# Altium project OZ440-SE100-CAR002.PrjPcb
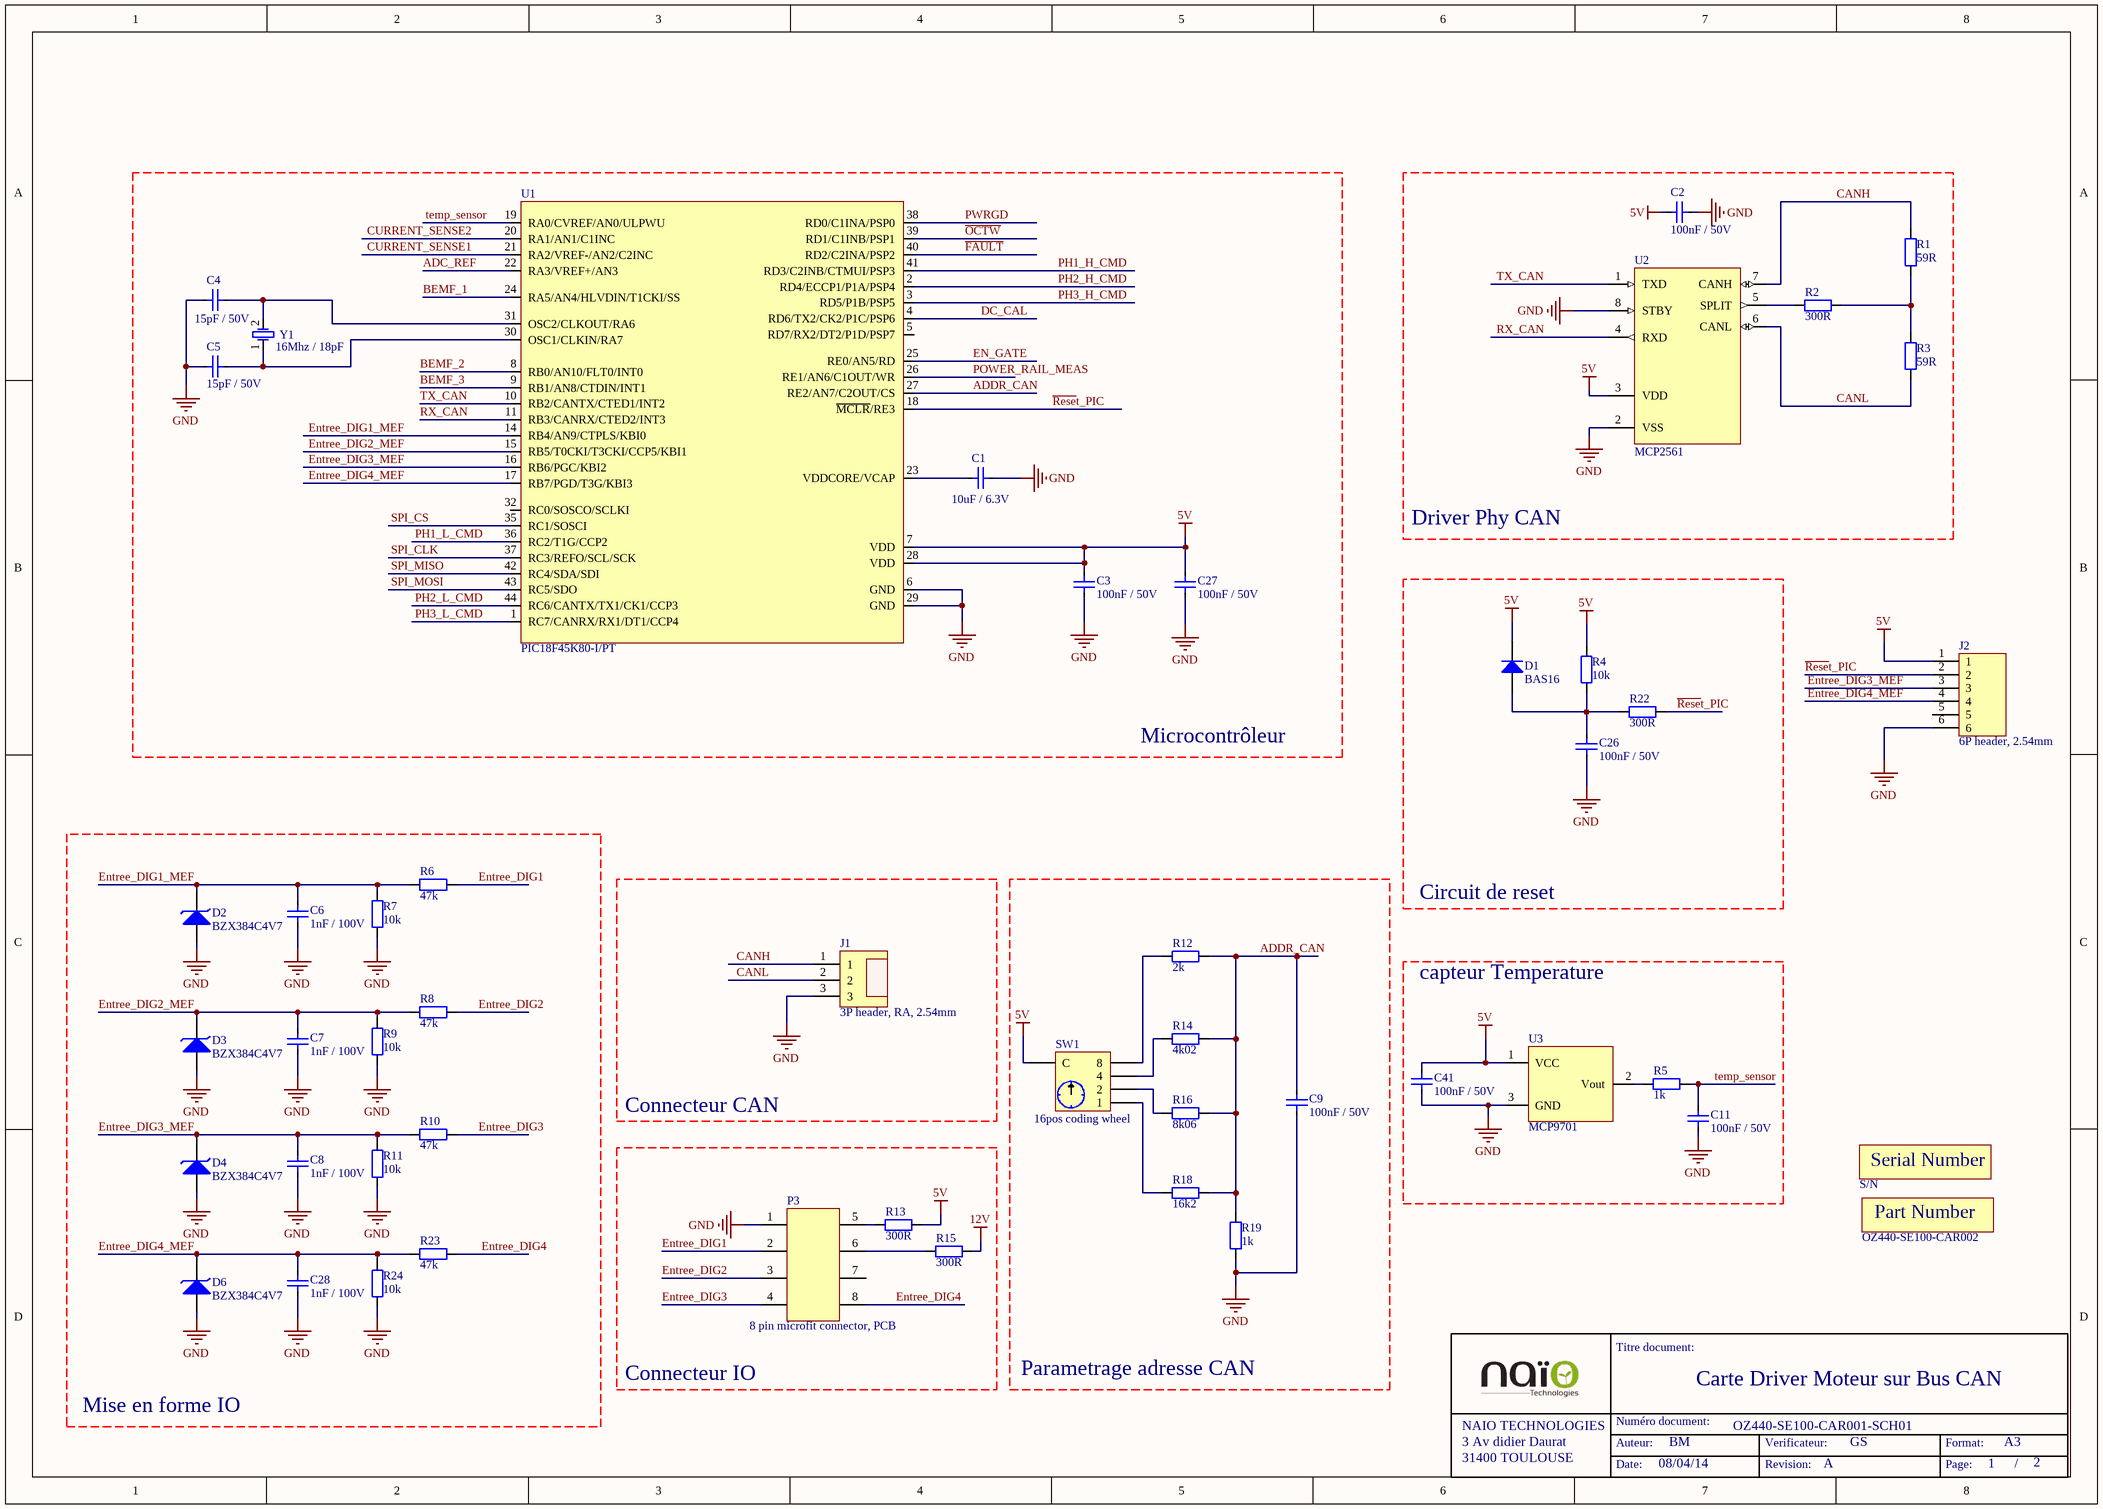
[diagram p0: OZ440-SE100-CAR002-SCH01_logique - Copie.SchDoc]
AssyDocumentNumber: OZ440-SE100-CAR002-Asb01; BoardName: Carte moteurs CAN; BoardPartNumber: OZ440-SE100-CAR002; BoardRevision: V1; DesignEngineer: Bruno M; DrillDocumentNumber: OZ440-SE100-CAR002-DRL01; ProjectTitle: Carte moteurs CAN; VerifEngineer: Pascal S
2 sheets, 110 parts. Net scope: global (net labels, ports and power ports of the same name join across sheets).
Board file: OZ440-SE100-CAR002.PcbDoc
Sheets:
  OZ440-SE100-CAR002-SCH01_logique - Copie.SchDoc
  OZ440-SE100-CAR002-SCH02_puissance.SchDoc

## Sheet OZ440-SE100-CAR002-SCH01_logique - Copie.SchDoc: Carte Driver Moteur sur Bus CAN
size A3; Date: 08/04/14; CheckedBy: GS; Author: BM; DocumentNumber: OZ440-SE100-CAR001-SCH01; Revision: A; SheetNumber: 1; SheetTotal: 2

### Parts
C1  Displayed reference: 10uF / 6.3V  [C0805-STD]  (hidden comment: CAP-SMD)
C2  Displayed reference: 100nF / 50V  [C0805-STD]  (hidden comment: CAP-SMD)
C3  Displayed reference: 100nF / 50V  [C0805-STD]  (hidden comment: CAP-SMD)
C4  Displayed reference: 15pF / 50V  [C0805-STD]  (hidden comment: CAP-SMD)
C5  Displayed reference: 15pF / 50V  [C0805-STD]  (hidden comment: CAP-SMD)
C6  Displayed reference: 1nF / 100V  [C0805-STD]  (hidden comment: CAP-SMD)
C7  Displayed reference: 1nF / 100V  [C0805-STD]  (hidden comment: CAP-SMD)
C8  Displayed reference: 1nF / 100V  [C0805-STD]  (hidden comment: CAP-SMD)
C9  Displayed reference: 100nF / 50V  [C0805-STD]  (hidden comment: CAP-SMD)
C11  Displayed reference: 100nF / 50V  [C0805-STD]  (hidden comment: CAP-SMD)
C26  Displayed reference: 100nF / 50V  [C0805-STD]  (hidden comment: CAP-SMD)
C27  Displayed reference: 100nF / 50V  [C0805-STD]  (hidden comment: CAP-SMD)
C28  Displayed reference: 1nF / 100V  [C0805-STD]  (hidden comment: CAP-SMD)
C41  Displayed reference: 100nF / 50V  [C0805-STD]  (hidden comment: CAP-SMD)
D1  Displayed reference: BAS16  [SOT23-STD]  (hidden comment: BAS16-SOT23)
D2  Displayed reference: BZX384C4V7  [SOD323-SPE-BZX384]  (hidden comment: DIODE_ZENER-SOD323)
D3  Displayed reference: BZX384C4V7  [SOD323-SPE-BZX384]  (hidden comment: DIODE_ZENER-SOD323)
D4  Displayed reference: BZX384C4V7  [SOD323-SPE-BZX384]  (hidden comment: DIODE_ZENER-SOD323)
D6  Displayed reference: BZX384C4V7  [SOD323-SPE-BZX384]  (hidden comment: DIODE_ZENER-SOD323)
J1  Displayed reference: 3P header, RA, 2.54mm  [CONN-SPE_MOLEX_0015913033]  (hidden comment: CONN-STD-3P_1ROW)
J2  Displayed reference: 6P header, 2.54mm  [6P_HEADER-STD_TH_1ROW]  (hidden comment: CONN-STD-6P_1ROW)
P3  Displayed reference: 8 pin microfit connector, PCB  [CONN-SPE_MOLEX_43045-0801]  (hidden comment: CONN-SPE-8P_MOLEX_43045-0801)
PN1  Displayed reference: OZ440-SE100-CAR002  [PART_NUMBER-STD]  (hidden comment: PART-NUMBER)
R1  Displayed reference: 59R  [R0805-STD]  (hidden comment: RES-SMD)
R2  Displayed reference: 300R  [R0805-STD]  (hidden comment: RES-SMD)
R3  Displayed reference: 59R  [R0805-STD]  (hidden comment: RES-SMD)
R4  Displayed reference: 10k  [R0805-STD]  (hidden comment: RES-SMD)
R5  Displayed reference: 1k  [R0805-STD]  (hidden comment: RES-SMD)
R6  Displayed reference: 47k  [R0805-STD]  (hidden comment: RES-SMD)
R7  Displayed reference: 10k  [R0805-STD]  (hidden comment: RES-SMD)
R8  Displayed reference: 47k  [R0805-STD]  (hidden comment: RES-SMD)
R9  Displayed reference: 10k  [R0805-STD]  (hidden comment: RES-SMD)
R10  Displayed reference: 47k  [R0805-STD]  (hidden comment: RES-SMD)
R11  Displayed reference: 10k  [R0805-STD]  (hidden comment: RES-SMD)
R12  Displayed reference: 2k  [R0805-STD]  (hidden comment: RES-SMD)
R13  Displayed reference: 300R  [R0805-STD]  (hidden comment: RES-SMD)
R14  Displayed reference: 4k02  [R0805-STD]  (hidden comment: RES-SMD)
R15  Displayed reference: 300R  [R0805-STD]  (hidden comment: RES-SMD)
R16  Displayed reference: 8k06  [R0805-STD]  (hidden comment: RES-SMD)
R18  Displayed reference: 16k2  [R0805-STD]  (hidden comment: RES-SMD)
R19  Displayed reference: 1k  [R0805-STD]  (hidden comment: RES-SMD)
R22  Displayed reference: 300R  [R0805-STD]  (hidden comment: RES-SMD)
R23  Displayed reference: 47k  [R0805-STD]  (hidden comment: RES-SMD)
R24  Displayed reference: 10k  [R0805-STD]  (hidden comment: RES-SMD)
SN1  Displayed reference: S/N  [SERIAL_NUMBER-STD]  (hidden comment: SERIAL-NUMBER)
SW1  Displayed reference: 16pos coding wheel  [SW-SPE-CTS_220-AMA16]  (hidden comment: Switch-STD-coding_wheel)
U1  Displayed reference: PIC18F45K80-I/PT  [TQFP44-SPE-PIC18F45k80]  (hidden comment: P18F45K80-TQFP44)
U2  Displayed reference: MCP2561  [SO8-SPE-MCP2561]  (hidden comment: MCP2561-SOIC08)
U3  Displayed reference: MCP9701  [SOT23-STD]  (hidden comment: MCP97XX-SOT23)
Y1  Displayed reference: 16Mhz / 18pF  [XTAL-SPE-HC49_SMD]  (hidden comment: XTAL-SMD)

### Nets
5V: C2.2 C3.2 C27.2 C41.2 D1.3(K) J2.1 R4.2 R13.2 SW1.C U1.7(VDD) U1.28(VDD) U2.3(VDD) U3.1(VCC)
12V: R15.2
GND: C1.2 C2.1 C3.1 C4.1 C5.1 C6.1 C7.1 C8.1 C9.1 C11.1 C26.1 C27.1 C28.1 C41.1 D2.A D3.A D4.A D6.A J1.3 J2.6 P3.1 R7.1 R9.1 R11.1 R19.1 R24.1 U1.6(GND) U1.29(GND) U2.2(VSS) U2.8(STBY) U3.3(GND)
~{FAULT}: U1.40(RD2/C2INA/PSP2)
~{OCTW}: U1.39(RD1/C1INB/PSP1)
~{Rese}t_PIC: J2.2 R22.2 U1.18(~{MCLR}/RE3)
ADC_REF: U1.22(RA3/VREF+/AN3)
ADDR_CAN: C9.2 R12.2 R14.2 R16.2 R18.2 R19.2 U1.27(RE2/AN7/C2OUT/CS)
BEMF_1: U1.24(RA5/AN4/HLVDIN/T1CKI/SS)
BEMF_2: U1.8(RB0/AN10/FLT0/INT0)
BEMF_3: U1.9(RB1/AN8/CTDIN/INT1)
CANH: J1.1 R1.2 U2.7(CANH)
CANL: J1.2 R3.1 U2.6(CANL)
CURRENT_SENSE1: U1.21(RA2/VREF-/AN2/C2INC)
CURRENT_SENSE2: U1.20(RA1/AN1/C1INC)
DC_CAL: U1.4(RD6/TX2/CK2/P1C/PSP6)
EN_GATE: U1.25(RE0/AN5/RD)
Entree_DIG1: P3.2 R6.1
Entree_DIG1_MEF: C6.2 D2.K R6.2 R7.2 U1.14(RB4/AN9/CTPLS/KBI0)
Entree_DIG2: P3.3 R8.1
Entree_DIG2_MEF: C7.2 D3.K R8.2 R9.2 U1.15(RB5/T0CKI/T3CKI/CCP5/KBI1)
Entree_DIG3: P3.4 R10.1
Entree_DIG3_MEF: C8.2 D4.K J2.3 R10.2 R11.2 U1.16(RB6/PGC/KBI2)
Entree_DIG4: P3.8 R23.1
Entree_DIG4_MEF: C28.2 D6.K J2.4 R23.2 R24.2 U1.17(RB7/PGD/T3G/KBI3)
PH1_H_CMD: U1.41(RD3/C2INB/CTMUI/PSP3)
PH1_L_CMD: U1.36(RC2/T1G/CCP2)
PH2_H_CMD: U1.2(RD4/ECCP1/P1A/PSP4)
PH2_L_CMD: U1.44(RC6/CANTX/TX1/CK1/CCP3)
PH3_H_CMD: U1.3(RD5/P1B/PSP5)
PH3_L_CMD: U1.1(RC7/CANRX/RX1/DT1/CCP4)
POWER_RAIL_MEAS: U1.26(RE1/AN6/C1OUT/WR)
PWRGD: U1.38(RD0/C1INA/PSP0)
RX_CAN: U1.11(RB3/CANRX/CTED2/INT3) U2.4(RXD)
SPI_CLK: U1.37(RC3/REFO/SCL/SCK)
SPI_CS: U1.35(RC1/SOSCI)
SPI_MISO: U1.42(RC4/SDA/SDI)
SPI_MOSI: U1.43(RC5/SDO)
temp_sensor: C11.2 R5.2 U1.19(RA0/CVREF/AN0/ULPWU)
TX_CAN: U1.10(RB2/CANTX/CTED1/INT2) U2.1(TXD)
NetC1_1: C1.1 U1.23(VDDCORE/VCAP)
NetC4_2: C4.2 U1.31(OSC2/CLKOUT/RA6) Y1.2(OSC2)
NetC5_2: C5.2 U1.30(OSC1/CLKIN/RA7) Y1.1(OSC1)
NetC26_2: C26.2 D1.1(A) R4.1 R22.1
NetP3_5: P3.5 R13.1
NetP3_6: P3.6 R15.1
NetR1_1: R1.1 R2.2 R3.2
NetR2_1: R2.1 U2.5(SPLIT)
NetR5_1: R5.1 U3.2(Vout)
NetR12_1: R12.1 SW1.8
NetR14_1: R14.1 SW1.4
NetR16_1: R16.1 SW1.2
NetR18_1: R18.1 SW1.1

Not connected (* = marked no-connect by the designer): J2 5; P3 7; U1 5(RD7/RX2/DT2/P1D/PSP7) 32(RC0/SOSCO/SCLKI)

### Notes on the sheet
- Driver Phy CAN
- Microcontrôleur
- Circuit de reset
- capteur Temperature
- Connecteur CAN
- Connecteur IO
- Parametrage adresse CAN
- Mise en forme IO
- Titre document:
- NAIO TECHNOLOGIES
- 3 Av didier Daurat
- 31400 TOULOUSE
- Auteur:
- Numéro document:
- Verificateur:
- Format:
- A3
- Date:
- Revision:
- Page:
- /
- (in symbol Large part number) Part Number

### Library data of the parts
C1 = C0805C106K9PACxx: 0805 10uF / 6.3V X5R ceramic capacitor; Manufacturer: Kemet; Max Voltage: 6.3; Tolerance: +/- 10%; Validated: N; Reference: C0805C106K9PACxx; Value: 10uF; Material: X5R; Footprint description: standard Capacitor 0805; Pin Count: 2; helpURL: http://www.farnell.com/datasheets/40863.pdf; Supplier 1: Farnell; Supplier Part Number 1: 1643357; Supplier 2: Digi-Key; Supplier Part Number 2: 399-3138-1-ND
C2 C3 C9 C11 C26 C27 C41 = VJ0805Y104KXAxx: 0805 100nF / 50V  X7R ceramic capacitor; Manufacturer: vishay; Max Voltage: 50; Tolerance: +/- 10%; Validated: N; Reference: VJ0805Y104KXAxx; Value: 100nF; Material: X7R; Footprint description: standard Capacitor 0805; Pin Count: 2; helpURL: http://www.vishay.com/docs/45200/highrels.pdf; Supplier 1: Farnell; Supplier Part Number 1: 1612208; Supplier 2: Digi-Key; Supplier Part Number 2: 720-1266-6-ND
C4 C5 = C0805C150J5GACxx: 0805 15pF / 50V COG ceramic capacitor; Manufacturer: Kemet; Max Voltage: 50; Tolerance: +/- 5%; Validated: N; Reference: C0805C150J5GACxx; Value: 15pF; Material: COG; Footprint description: standard Capacitor 0805; Pin Count: 2; helpURL: http://www.farnell.com/datasheets/40863.pdf; Supplier 1: Farnell; Supplier Part Number 1: 1650868; Supplier 2: Digi-Key; Supplier Part Number 2: 399-1111-1-ND
C6-C8 C28 = VJ0805Y102KXBxx: 0805 1nF / 100V X7R ceramic capacitor; Manufacturer: vishay; Max Voltage: 50; Tolerance: +/- 10%; Validated: N; Reference: VJ0805Y102KXBxx; Value: 1nF; Material: X7R; Footprint description: standard Capacitor 0805; Pin Count: 2; helpURL: http://www.vishay.com/docs/45200/highrels.pdf; Supplier 1: Farnell; Supplier Part Number 1: 1555112; Supplier 2: Digi-Key; Supplier Part Number 2: 720-1264-1-ND
D1 = BAS16: 100V / 120mA signal  diode; Manufacturer: NXP; Max Voltage: 100; Max Current: 0.2A; Validated: False; Reference: BAS16; component type: DIODE; Footprint description: Sot23 SMD package; Pin Count: 3; Rev: 2010; helpURL: http://www.nxp.com/documents/data_sheet/BAS16_SER.pdf; Supplier 1: Farnell; Supplier Part Number 1: 1081180; Supplier 2: Digi-Key; Supplier Part Number 2: 568-1596-1-ND
D2-D4 D6 = BZX384C4V7: 4.7V zener diode; Manufacturer: VISHAY; Rated Power: 200mW; Validated: FALSE; Reference: BZX384C4V7; component type: Zener diode; Value: 4.7V; Footprint description: SOD323; Pin Count: 2; Rev: 1.9; helpURL: http://www.vishay.com/docs/85764/bzx384.pdf; Supplier 1: Mouser; Supplier Part Number 1: 771-BZX384-C4V7115; Supplier 2: Farnell; Supplier Part Number 2: 8735700
J1 = 0015913033: 3 pin , 2.54mm SMD header; Manufacturer: Molex; Validated: False; Reference: 0015913033; Footprint description: 3P header, RA, 2.54mm; Pin Count: 3; Rev: G; helpURL: http://www.molex.com/pdm_docs/sd/015913033_sd.pdf; Supplier 1: Mouser; Supplier Part Number 1: 538-15-91-3033; Supplier 2: Digi-Key; Supplier Part Number 2: 0015913033-ND
J2 = 68000-406HLF: 6P, 1 row, 2.54mm header; Manufacturer: FCI; Validated: False; Reference: 68000-406HLF; Footprint description: TH, 6 pin, 2.54mm; Pin Count: 6; Rev: DB; helpURL: http://portal.fciconnect.com/Comergent//fci/drawing/68000.pdf
P3 = 43045-0801: 8 pin Microfit connector; Manufacturer: Molex; Max Voltage: 600V; Max Current: 5A; Validated: False; Reference: 43045-0801; Footprint description: 8 pin SMT connector RA, TH; Pin Count: 8; Rev: F; helpURL: http://www.molex.com/pdm_docs/sd/430450801_sd.pdf; Supplier 1: Mouser; Supplier Part Number 1: 538-43045-0801; Supplier 2: Digi-Key; Supplier Part Number 2: WM3253-ND
PN1 = Large part number: large part number copper identification; Validated: False; Reference: Large part number
R1 R3 = CRCW080559R0FKxx: 59 Ohm 0805 SMD resistor; Manufacturer: Vishay; Value: 59; Tolerance: 1 %; Rated Power: 0.125 W; Validated: No; Reference: CRCW080559R0FKxx; Footprint description: standard 0805 SMD; Pin Count: 2; helpURL: http://www.vishay.com/docs/20035/dcrcwe3.pdf; Supplier 1: Mouser; Supplier Part Number 1: 71-CRCW080559R0FKEA; Supplier 2: Farnell; Supplier Part Number 2: 2138817
R2 R13 R15 R22 = CRCW0805300RFKxx: 300 ohm 0805 SMD resistor; Manufacturer: Vishay; Value: 300; Tolerance: 1%; Rated Power: 0.125W; Validated: No; Reference: CRCW0805300RFKxx; Footprint description: standard 0805 SMD; Pin Count: 2; helpURL: http://www.vishay.com/docs/20035/dcrcwe3.pdf; Supplier 1: Mouser; Supplier Part Number 1: 71-CRCW0805300RFKEA; Supplier 2: Farnell; Supplier Part Number 2: 1152346
R4 R7 R9 R11 R24 = CRCW080510K0FKxx: 10k Ohm 0805 SMD resistor; Manufacturer: Vishay; Value: 10 000; Tolerance: 1 %; Rated Power: 0,125 W; Validated: No; Reference: CRCW080510K0FKxx; Footprint description: standard 0805 SMD; Pin Count: 2; helpURL: http://www.vishay.com/docs/20035/dcrcwe3.pdf; Supplier 1: Farnell; Supplier Part Number 1: 1469856; Supplier 2: Mouser; Supplier Part Number 2: 71-CRCW0805-10K-E3
R5 R19 = CRCW08051K00FKxx: 1k Ohm 0805 SMD resistor; Manufacturer: Vishay; Value: 1 000; Tolerance: 1 %; Rated Power: 0,125 W; Validated: No; Reference: CRCW08051K00FKxx; Footprint description: standard 0805 SMD; Pin Count: 2; helpURL: http://www.vishay.com/docs/20035/dcrcwe3.pdf; Supplier 1: Farnell; Supplier Part Number 1: 1469847; Supplier 2: Mouser; Supplier Part Number 2: 71-CRCW0805-1.0K-E3
R6 R8 R10 R23 = CRCW080547K0FKxx: 47k Ohm 0805 SMD resistor; Manufacturer: Vishay; Value: 47 000; Tolerance: 1 %; Rated Power: 0,125 W; Validated: No; Reference: CRCW080547K0FKxx; Footprint description: standard 0805 SMD; Pin Count: 2; helpURL: http://www.vishay.com/docs/20035/dcrcwe3.pdf; Supplier 1: Farnell; Supplier Part Number 1: 1469929; Supplier 2: Mouser; Supplier Part Number 2: 71-CRCW0805-47K-E3
R12 = CRCW08052K00FKxx: 2k Ohm 0805 SMD resistor; Manufacturer: Vishay; Value: 2 000; Tolerance: 1%; Rated Power: 0.125W; Validated: No; Reference: CRCW08052K00FKxx; Footprint description: standard 0805 SMD; Pin Count: 2; helpURL: http://www.vishay.com/docs/20035/dcrcwe3.pdf; Supplier 1: Mouser; Supplier Part Number 1: 71-CRCW08052K00FKEB; Supplier 2: Farnell; Supplier Part Number 2: 1469884
R14 = CRCW08054K02FKxx: 4k02 Ohm 0805 SMD resistor; Manufacturer: Vishay; Value: 4 020; Tolerance: 1%; Rated Power: 0.125W; Validated: No; Reference: CRCW08054K02FKxx; Footprint description: standard 0805 SMD; Pin Count: 2; helpURL: http://www.vishay.com/docs/20035/dcrcwe3.pdf; Supplier 1: Farnell; Supplier Part Number 1: 1469920; Supplier 2: Mouser; Supplier Part Number 2: 71-CRCW0805-4.02K-E3
R16 = CRCW08058K06FKxx: 8k06 Ohm 0805 SMD resistor; Manufacturer: Vishay; Value: 8 060; Tolerance: 1%; Rated Power: 0.125W; Validated: No; Reference: CRCW08058K06FKxx; Footprint description: standard 0805 SMD; Pin Count: 2; helpURL: http://www.vishay.com/docs/20035/dcrcwe3.pdf; Supplier 1: Farnell; Supplier Part Number 1: 1653038; Supplier 2: Mouser; Supplier Part Number 2: 71-CRCW0805-8.06K-E3
R18 = CRCW080516K2FKxx: 16k2 Ohm 0805 SMD resistor; Manufacturer: Vishay; Value: 16200; Tolerance: 1%; Rated Power: 0.125W; Validated: No; Reference: CRCW080516K2FKxx; Footprint description: standard 0805 SMD; Pin Count: 2; helpURL: http://www.vishay.com/docs/20035/dcrcwe3.pdf; Supplier 1: Mouser; Supplier Part Number 1: 71-CRCW0805-16.2K-E3; Supplier 2: Farnell; Supplier Part Number 2: 1469878
SN1 = Serial Number: serial number copper identification; Validated: False; Reference: Serial Number
SW1 = 220AMA16x: 16 positions rotary dip switch; Manufacturer: CTS; Validated: False; Reference: 220AMA16x; Footprint description: 10x10mm SMD; Pin Count: 6; Rev: 20/02/14; helpURL: http://www.ctscorp.com/components/Datasheets/220.pdf; Supplier 1: Mouser; Supplier Part Number 1: 774-220AMA16R; Supplier 2: Digi-Key; Supplier Part Number 2: CT3072-6-ND
U1 = PIC18F45K80-I/PT: Pic microcontroller with embeded CAN controller; Manufacturer: MICROCHIP; Validated: False; Reference: PIC18F45K80-I/PT; Footprint description: standard TQFP 44 pin; Pin Count: 44; Rev: F; helpURL: http://ww1.microchip.com/downloads/en/DeviceDoc/39977f.pdf; Supplier 1: Farnell; Supplier Part Number 1: 1823169; Supplier 2: Mouser; Supplier Part Number 2: 579-PIC18F45K80-I/PT
U2 = MCP2561-E/SN: CAN transceiver with common mode stabilisation; Manufacturer: Microchip; Max Voltage: 5.5V; Validated: False; Reference: MCP2561-E/SN; Footprint description: standard SO8; Pin Count: 8; Rev: B; helpURL: http://ww1.microchip.com/downloads/en/DeviceDoc/25167B.pdf; Supplier 1: Farnell; Supplier Part Number 1: 2362837; Supplier 2: Mouser; Supplier Part Number 2: 579-MCP2561-E/SN
U3 = MCP9701AT-E/TT: temperature sensor with voltage output; Manufacturer: Microchip; Max Voltage: 5.5V; Reference: MCP9701AT-E/TT; Footprint description: SOT23; Pin Count: 3; Rev: E; helpURL: http://ww1.microchip.com/downloads/en/DeviceDoc/21942e.pdf; Supplier 1: Mouser; Supplier Part Number 1: 579-MCP9701AT-E/TT; Supplier 2: Farnell; Supplier Part Number 2: 1834864
Y1 = MCRSD16000F183000RR: 16Mhz Crystal; Manufacturer: Multicomp; Value: 16 000; Validated: False; Reference: MCRSD16000F183000RR; Footprint description: HC49 /US SMD; Pin Count: 2; Frequency band: 16Mhz; Rev: 1.0; helpURL: http://www.farnell.com/datasheets/1801275.pdf; Supplier 1: Farnell; Supplier Part Number 1: 2395958

## Sheet OZ440-SE100-CAR002-SCH02_puissance.SchDoc: Carte Driver Moteur sur Bus CAN
size A3; Date: 08/04/14; CheckedBy: GS; Author: BM; DocumentNumber: OZ440-SE100-CAR001-SCH02; Revision: A; SheetNumber: 1; SheetTotal: 2; DocumentName: Carte puissance
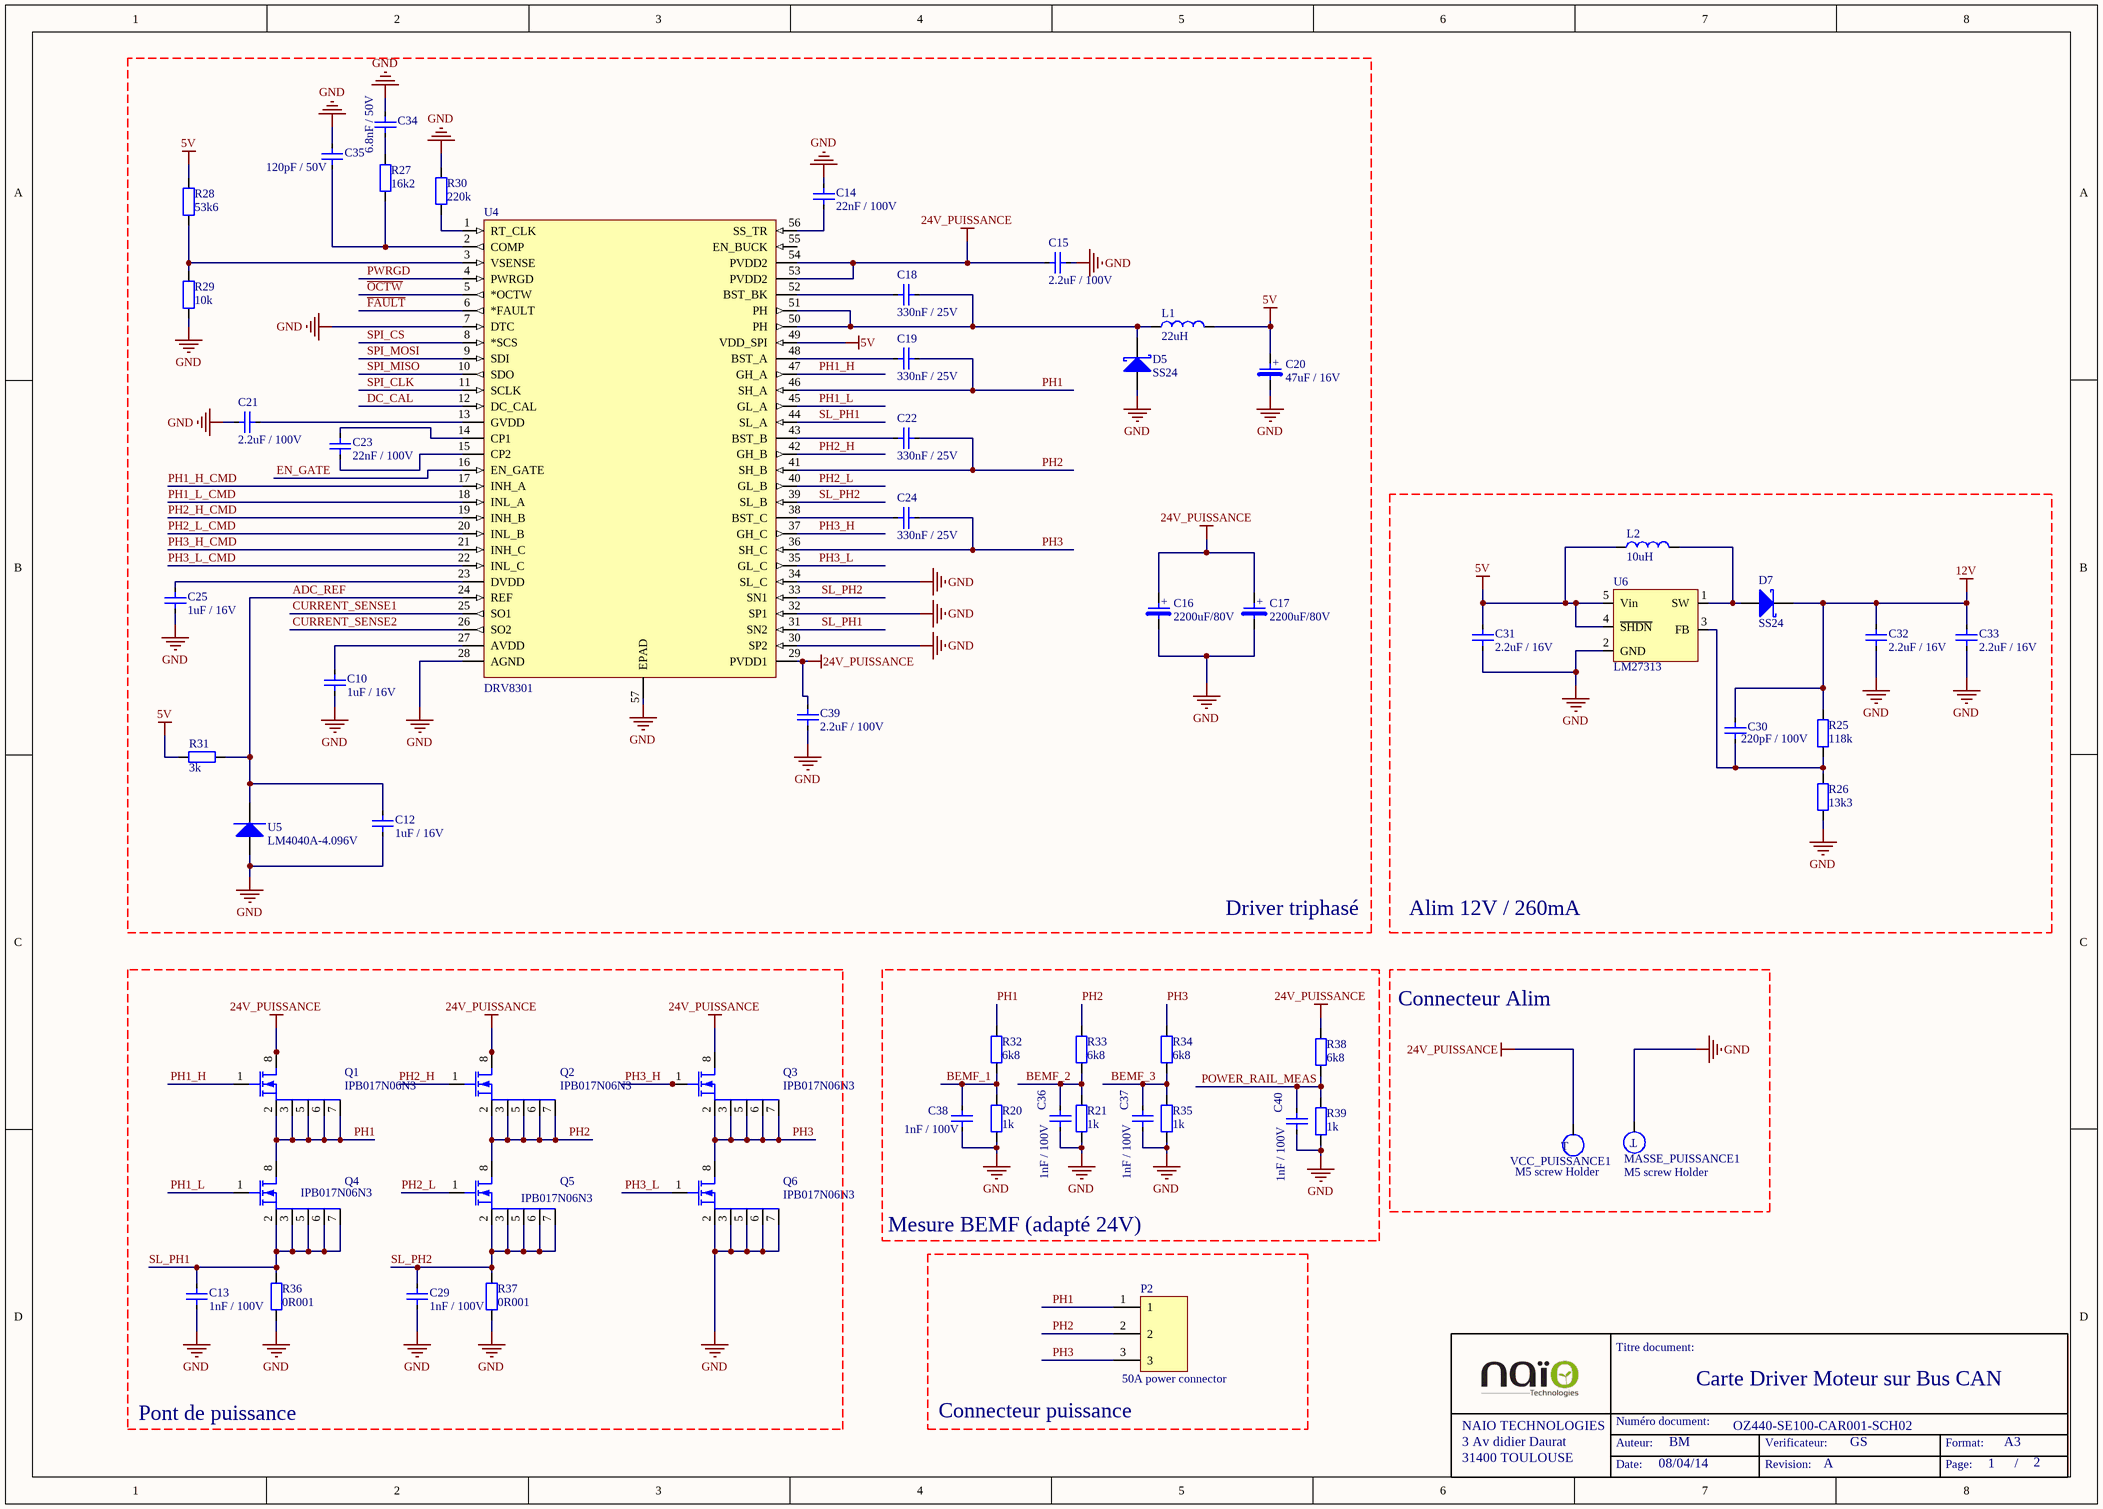
[diagram p1: OZ440-SE100-CAR002-SCH02_puissance.SchDoc]

### Parts
C10  Displayed reference: 1uF / 16V  [C0805-STD]  (hidden comment: CAP-SMD)
C12  Displayed reference: 1uF / 16V  [C0805-STD]  (hidden comment: CAP-SMD)
C13  Displayed reference: 1nF / 100V  [C0805-STD]  (hidden comment: CAP-SMD)
C14  Displayed reference: 22nF / 100V  [C0805-STD]  (hidden comment: CAP-SMD)
C15  Displayed reference: 2.2uF / 100V  [C1206-STD]  (hidden comment: CAP-SMD)
C16  Displayed reference: 2200uF/80V  [SNAP_IN_10mm-SPE-SLPX]  (hidden comment: CAP-POL-SMD)
C17  Displayed reference: 2200uF/80V  [SNAP_IN_10mm-SPE-SLPX]  (hidden comment: CAP-POL-SMD)
C18  Displayed reference: 330nF / 25V  [C0805-STD]  (hidden comment: CAP-SMD)
C19  Displayed reference: 330nF / 25V  [C0805-STD]  (hidden comment: CAP-SMD)
C20  Displayed reference: 47uF / 16V  [C_size_C-STD]  (hidden comment: CAP-POL-SMD)
C21  Displayed reference: 2.2uF / 100V  [C1206-STD]  (hidden comment: CAP-SMD)
C22  Displayed reference: 330nF / 25V  [C0805-STD]  (hidden comment: CAP-SMD)
C23  Displayed reference: 22nF / 100V  [C0805-STD]  (hidden comment: CAP-SMD)
C24  Displayed reference: 330nF / 25V  [C0805-STD]  (hidden comment: CAP-SMD)
C25  Displayed reference: 1uF / 16V  [C0805-STD]  (hidden comment: CAP-SMD)
C29  Displayed reference: 1nF / 100V  [C0805-STD]  (hidden comment: CAP-SMD)
C30  Displayed reference: 220pF / 100V  [C0805-STD]  (hidden comment: CAP-SMD)
C31  Displayed reference: 2.2uF / 16V  [C0805-STD]  (hidden comment: CAP-SMD)
C32  Displayed reference: 2.2uF / 16V  [C0805-STD]  (hidden comment: CAP-SMD)
C33  Displayed reference: 2.2uF / 16V  [C0805-STD]  (hidden comment: CAP-SMD)
C34  Displayed reference: 6.8nF / 50V  [C0805-STD]  (hidden comment: CAP-SMD)
C35  Displayed reference: 120pF / 50V  [C0805-STD]  (hidden comment: CAP-SMD)
C36  Displayed reference: 1nF / 100V  [C0805-STD]  (hidden comment: CAP-SMD)
C37  Displayed reference: 1nF / 100V  [C0805-STD]  (hidden comment: CAP-SMD)
C38  Displayed reference: 1nF / 100V  [C0805-STD]  (hidden comment: CAP-SMD)
C39  Displayed reference: 2.2uF / 100V  [C1206-STD]  (hidden comment: CAP-SMD)
C40  Displayed reference: 1nF / 100V  [C0805-STD]  (hidden comment: CAP-SMD)
D5  Displayed reference: SS24  [DO214AA-STD]  (hidden comment: DIODE_SCHOTKY-DO214AA)
D7  Displayed reference: SS24  [DO214AA-STD]  (hidden comment: DIODE_SCHOTKY-DO214AA)
L1  Displayed reference: 22uH  [L-SPE-LPS6235]  (hidden comment: IND-SMD)
L2  Displayed reference: 10uH  [L-SPE-PFL4514]  (hidden comment: IND-SMD)
MASSE_PUISSANCE1  Displayed reference: M5 screw Holder  [MEC-SPE-WURTHZ_7460408]  (hidden comment: TP-STD-TEST_POINT)
P2  Displayed reference: 50A power connector  [CONN-SPE-428203213_MOLEX]  (hidden comment: CONN-STD-3P_puissance)
Q1  Displayed reference: IPB017N06N3  [TO263-3-SPE-IPB039N10N3]  (hidden comment: IPB039N10N3-PGTO263_3)
Q2  Displayed reference: IPB017N06N3  [TO263-3-SPE-IPB039N10N3]  (hidden comment: IPB039N10N3-PGTO263_3)
Q3  Displayed reference: IPB017N06N3  [TO263-3-SPE-IPB039N10N3]  (hidden comment: IPB039N10N3-PGTO263_3)
Q4  Displayed reference: IPB017N06N3  [TO263-3-SPE-IPB039N10N3]  (hidden comment: IPB039N10N3-PGTO263_3)
Q5  Displayed reference: IPB017N06N3  [TO263-3-SPE-IPB039N10N3]  (hidden comment: IPB039N10N3-PGTO263_3)
Q6  Displayed reference: IPB017N06N3  [TO263-3-SPE-IPB039N10N3]  (hidden comment: IPB039N10N3-PGTO263_3)
R20  Displayed reference: 1k  [R0603-STD]  (hidden comment: RES-SMD)
R21  Displayed reference: 1k  [R0603-STD]  (hidden comment: RES-SMD)
R25  Displayed reference: 118k  [R0805-STD]  (hidden comment: RES-SMD)
R26  Displayed reference: 13k3  [R0805-STD]  (hidden comment: RES-SMD)
R27  Displayed reference: 16k2  [R0805-STD]  (hidden comment: RES-SMD)
R28  Displayed reference: 53k6  [R0805-STD]  (hidden comment: RES-SMD)
R29  Displayed reference: 10k  [R0805-STD]  (hidden comment: RES-SMD)
R30  Displayed reference: 220k  [R0805-STD]  (hidden comment: RES-SMD)
R31  Displayed reference: 3k  [R0805-STD]  (hidden comment: RES-SMD)
R32  Displayed reference: 6k8  [R0805-STD]  (hidden comment: RES-SMD)
R33  Displayed reference: 6k8  [R0805-STD]  (hidden comment: RES-SMD)
R34  Displayed reference: 6k8  [R0805-STD]  (hidden comment: RES-SMD)
R35  Displayed reference: 1k  [R0603-STD]  (hidden comment: RES-SMD)
R36  Displayed reference: 0R001  [R2512-STD]  (hidden comment: RES-SMD)
R37  Displayed reference: 0R001  [R2512-STD]  (hidden comment: RES-SMD)
R38  Displayed reference: 6k8  [R0805-STD]  (hidden comment: RES-SMD)
R39  Displayed reference: 1k  [R0603-STD]  (hidden comment: RES-SMD)
U4  Displayed reference: DRV8301  [TSSOP56-SPE-DRV8301]  (hidden comment: DRV8301-TSSOP56)
U5  Displayed reference: LM4040A-4.096V  [SOT23-SPE-LM4040]  (hidden comment: LM4040-SOT23)
U6  Displayed reference: LM27313  [SOT23_5-SPE-LM27313]  (hidden comment: LM27313-SOT23_5P)
VCC_PUISSANCE1  Displayed reference: M5 screw Holder  [MEC-SPE-WURTHZ_7460408]  (hidden comment: TP-STD-TEST_POINT)

### Nets
5V: C20.1 C31.2 L1.2 L2.1 R28.2 R31.1 U4.49(VDD_SPI) U6.4(~{SHDN}) U6.5(Vin)
12V: C30.2 C32.2 C33.2 D7.K R25.2
24V_PUISSANCE: C15.2 C16.1 C17.1 C39.1 Q1.8(S) Q2.8(S) Q3.8(S) R38.2 U4.29(PVDD1) U4.53(PVDD2) U4.54(PVDD2) VCC_PUISSANCE1.1(T)
GND: C10.1 C12.1 C13.1 C14.2 C15.1 C16.2 C17.2 C20.2 C21.1 C25.1 C29.1 C31.1 C32.1 C33.1 C34.2 C35.2 C36.1 C37.1 C38.1 C39.2 C40.1 D5.A MASSE_PUISSANCE1.1(T) Q6.2(D) Q6.3(D) Q6.5(D) Q6.6(D) Q6.7(D) R20.1 R21.1 R26.1 R29.1 R30.2 R35.1 R36.1 R37.1 R39.1 U4.7(DTC) U4.28(AGND) U4.30(SP2) U4.32(SP1) U4.34(SL_C) U4.57(EPAD) U5.A U6.2(GND)
~{FAULT}: U4.6(*FAULT)
~{OCTW}: U4.5(*OCTW)
ADC_REF: C12.2 R31.2 U4.24(REF) U5.K
BEMF_1: C38.2 R20.2 R32.1
BEMF_2: C36.2 R21.2 R33.1
BEMF_3: C37.2 R34.1 R35.2
CURRENT_SENSE1: U4.25(SO1)
CURRENT_SENSE2: U4.26(SO2)
DC_CAL: U4.12(DC_CAL)
EN_GATE: U4.16(EN_GATE)
PH1: C19.2 P2.1 Q1.2(D) Q1.3(D) Q1.5(D) Q1.6(D) Q1.7(D) Q4.8(S) R32.2 U4.46(SH_A)
PH1_H: Q1.1(G) U4.47(GH_A)
PH1_H_CMD: U4.17(INH_A)
PH1_L: Q4.1(G) U4.45(GL_A)
PH1_L_CMD: U4.18(INL_A)
PH2: C22.2 P2.2 Q2.2(D) Q2.3(D) Q2.5(D) Q2.6(D) Q2.7(D) Q5.8(S) R33.2 U4.41(SH_B)
PH2_H: Q2.1(G) U4.42(GH_B)
PH2_H_CMD: U4.19(INH_B)
PH2_L: Q5.1(G) U4.40(GL_B)
PH2_L_CMD: U4.20(INL_B)
PH3: C24.2 P2.3 Q3.2(D) Q3.3(D) Q3.5(D) Q3.6(D) Q3.7(D) Q6.8(S) R34.2 U4.36(SH_C)
PH3_H: Q3.1(G) U4.37(GH_C)
PH3_H_CMD: U4.21(INH_C)
PH3_L: Q6.1(G) U4.35(GL_C)
PH3_L_CMD: U4.22(INL_C)
POWER_RAIL_MEAS: C40.2 R38.1 R39.2
PWRGD: U4.4(PWRGD)
SL_PH1: C13.2 Q4.2(D) Q4.3(D) Q4.5(D) Q4.6(D) Q4.7(D) R36.2 U4.31(SN2) U4.44(SL_A)
SL_PH2: C29.2 Q5.2(D) Q5.3(D) Q5.5(D) Q5.6(D) Q5.7(D) R37.2 U4.33(SN1) U4.39(SL_B)
SPI_CLK: U4.11(SCLK)
SPI_CS: U4.8(*SCS)
SPI_MISO: U4.10(SDO)
SPI_MOSI: U4.9(SDI)
NetC10_2: C10.2 U4.27(AVDD)
NetC14_1: C14.1 U4.56(SS_TR)
NetC18_1: C18.1 U4.52(BST_BK)
NetC18_2: C18.2 D5.K L1.1 U4.50(PH) U4.51(PH)
NetC19_1: C19.1 U4.48(BST_A)
NetC21_2: C21.2 U4.13(GVDD)
NetC22_1: C22.1 U4.43(BST_B)
NetC23_1: C23.1 U4.15(CP2)
NetC23_2: C23.2 U4.14(CP1)
NetC24_1: C24.1 U4.38(BST_C)
NetC25_2: C25.2 U4.23(DVDD)
NetC30_1: C30.1 R25.1 R26.2 U6.3(FB)
NetC34_1: C34.1 R27.2
NetC35_1: C35.1 R27.1 U4.2(COMP)
NetD7_A: D7.A L2.2 U6.1(SW)
NetR28_1: R28.1 R29.2 U4.3(VSENSE)
NetR30_1: R30.1 U4.1(RT_CLK)

Not connected (* = marked no-connect by the designer): U4 55(EN_BUCK)

### Notes on the sheet
- Driver triphasé
- Alim 12V / 260mA
- Connecteur Alim
- Mesure BEMF (adapté 24V)
- Pont de puissance
- (near P2) Connecteur puissance
- Titre document:
- NAIO TECHNOLOGIES
- 3 Av didier Daurat
- 31400 TOULOUSE
- Auteur:
- Numéro document:
- Verificateur:
- Format:
- A3
- Date:
- Revision:
- Page:
- /
- (in symbol SLPX222M080C3P3) +
- (in symbol TPSC476K016x0110) +

### Library data of the parts
C10 C12 C25 = C0805C105K4RACxx: 0805 1uF / 16V X7R ceramic capacitor; Manufacturer: Kemet; Max Voltage: 16; Tolerance: +/- 10%; Validated: N; Reference: C0805C105K4RACxx; Value: 1uF; Material: X7R; Footprint description: standard Capacitor 0805; Pin Count: 2; helpURL: http://www.farnell.com/datasheets/40863.pdf; Supplier 1: Farnell; Supplier Part Number 1: 9227792; Supplier 2: Digi-Key; Supplier Part Number 2: 399-6930-1-ND
C13 C29 C36-C38 C40 = VJ0805Y102KXBxx: as C6 on sheet OZ440-SE100-CAR002-SCH01_logique - Copie; Reference: VJ0805Y102KXBxx; Value: 1nF; Material: X7R; Footprint description: standard Capacitor 0805; Pin Count: 2; helpURL: http://www.vishay.com/docs/45200/highrels.pdf; Supplier 1: Farnell; Supplier Part Number 1: 1555112; Supplier 2: Digi-Key; Supplier Part Number 2: 720-1264-1-ND
C14 C23 = VJ0805Y223KXBxx: 0805 22nF / 100V X7R ceramic capacitor; Manufacturer: vishay; Value: 100nF; Max Voltage: 100; Tolerance: +/- 10%; Validated: N; Reference: VJ0805Y223KXBxx; Material: X7R; Footprint description: standard Capacitor 0805; Pin Count: 2; helpURL: http://www.vishay.com/docs/45200/highrels.pdf; Supplier 1: Mouser; Supplier Part Number 1: 77-VJ0805Y223KXBBC31; Supplier 2: Farnell; Supplier Part Number 2: 2407374
C15 C21 C39 = C3216X7S2A225Kxxx: 1206 2.2uF / 100V X7S ceramic capacitor; Manufacturer: TDK; Max Voltage: 100; Tolerance: +/- 10%; Validated: N; Reference: C3216X7S2A225Kxxx; Value: 2.2uF; Material: X7S; Footprint description: standard Capacitor 1206; Pin Count: 2; helpURL: http://www.mouser.com/ds/2/400/C3216X7S2A225K160AB-265429.pdf; Supplier 1: Mouser; Supplier Part Number 1: 810-C3216X7S2A225K; Supplier 2: Farnell; Supplier Part Number 2: 2112717
C16 C17 = SLPX222M080C3P3: 2200uF/80V Aluminium capacitor, snap in; Manufacturer: Cornell dubilier; Value: 2200uF; Max Voltage: 80V; Max Current: 2.8A; Validated: False; Reference: SLPX222M080C3P3; Footprint description: 10mm snap in; Pin Count: 2; helpURL: http://www.cde.com/catalogs/SLPX.pdf; Supplier 1: Farnell; Supplier Part Number 1: 1604336; Supplier 2: Mouser; Supplier Part Number 2: 598-SLPX222M080C3P3
C18 C19 C22 C24 = VJ0805Y334KXXxx: 0805 330nF / 25V X7R ceramic capacitor; Manufacturer: vishay; Max Voltage: 25; Tolerance: +/- 10%; Validated: N; Reference: VJ0805Y334KXXxx; Value: 330nF; Material: X7R; Footprint description: standard Capacitor 0805; Pin Count: 2; helpURL: http://www.vishay.com/docs/45200/highrels.pdf; Supplier 1: Mouser; Supplier Part Number 1: 77-VJ0805Y334KXXTBC; Supplier 2: Newark; Supplier Part Number 2: 73W9150
C20 = TPSC476K016x0110: 47uF / 16V low ESR capacitor (110mR); Manufacturer: AVX; Max Current: 0,9A ripple @100kHz; Validated: False; Reference: TPSC476K016x0110; Value: 47uF; Max Voltage: 16V; Footprint description: Case code C, SMD; Pin Count: 2; helpURL: http://www.avx.com/docs/Catalogs/tps.pdf; Supplier 1: Farnell; Supplier Part Number 1: 1658587; Supplier 2: Mouser; Supplier Part Number 2: 581-TPSC476K016R0110
C30 = C0805C221J5GACxx: 0805 220pF / 100V COG ceramic capacitor; Manufacturer: Kemet; Max Voltage: 100; Tolerance: +/- 5%; Validated: N; Reference: C0805C221J5GACxx; Value: 220pF; Material: COG; Footprint description: standard Capacitor 0805; Pin Count: 2; helpURL: http://www.farnell.com/datasheets/40863.pdf; Supplier 1: Mouser; Supplier Part Number 1: 80-C0805C221J5GACTM; Supplier 2: Farnell; Supplier Part Number 2: 2392193
C31-C33 = C0805C225K4PACxx: 0805 2.2uF / 16V X5R ceramic capacitor; Manufacturer: Kemet; Max Voltage: 16; Tolerance: +/- 10%; Validated: N; Reference: C0805C225K4PACxx; Value: 2.2uF; Material: X5R; Footprint description: standard Capacitor 0805; Pin Count: 2; helpURL: http://www.farnell.com/datasheets/40863.pdf; Supplier 1: Digi-Key; Supplier Part Number 1: 399-8054-1-ND; Supplier 2: Mouser; Supplier Part Number 2: 80-C0805C225K4P
C34 = C0805C682J5GACxx: 0805 6.8nF / 50V COG ceramic capacitor; Manufacturer: Kemet; Max Voltage: 50; Tolerance: +/- 5%; Validated: N; Reference: C0805C682J5GACxx; Value: 6.8nF; Material: COG; Footprint description: standard Capacitor 0805; Pin Count: 2; helpURL: http://www.farnell.com/datasheets/40863.pdf; Supplier 1: Mouser; Supplier Part Number 1: 80-C0805C682J5G; Supplier 2: Farnell; Supplier Part Number 2: 1535571
C35 = C0805C121J5GACxx: 0805 120pF / 50V COG ceramic capacitor; Manufacturer: Kemet; Max Voltage: 50; Tolerance: +/- 5%; Validated: N; Reference: C0805C121J5GACxx; Value: 120pF; Material: COG; Footprint description: standard Capacitor 0805; Pin Count: 2; helpURL: http://www.farnell.com/datasheets/40863.pdf; Supplier 1: Mouser; Supplier Part Number 1: 80-C0805C121J5GACTM; Supplier 2: Farnell; Supplier Part Number 2: 1414667
D5 D7 = SS24-E3/xxx: 2A/40V schottky diode in SMB package; Manufacturer: VISHAY; Max Voltage: 40V; Max Current: 2A; Validated: False; Reference: SS24-E3/xxx; component type: DIODE; Footprint description: DO-214AA SMD footprint; Pin Count: 2; Rev: 03/2012; helpURL: http://www.vishay.com/docs/88748/88748.pdf; Supplier 1: Mouser; Supplier Part Number 1: 625-SS24-E3; Supplier 2: Farnell; Supplier Part Number 2: 1843487
L1 = LPS6235-223MR: 22uH SMD inductor; Manufacturer: Coilcraft; Max Current: 1.6A; Validated: False; Reference: LPS6235-223MR; Value: 22uH; Footprint description: SMD 2 pin low profile; Pin Count: 2; Rev: 08/01/13; helpURL: http://www.coilcraft.com/pdfs/lps6235.pdf; Supplier 1: Mouser; Supplier Part Number 1: 994-LPS6235-223MRB; Supplier 2: Farnell; Supplier Part Number 2: 2408291
L2 = PFL4514-103ME: 10uH SMD inductor; Manufacturer: COILCRAFT; Max Current: 1.4A; Validated: False; Reference: PFL4514-103ME; Value: 10uH; Footprint description: SMD 2 pin low profile; Pin Count: 2; Rev: 12/13/11; helpURL: http://www.coilcraft.com/pdf_viewer/showpdf.cfm?f=pdf_store:pfl4514.pdf; Supplier 1: Mouser; Supplier Part Number 1: 994-PFL4514-103MEB; Supplier 2: Farnell; Supplier Part Number 2: 2288778
MASSE_PUISSANCE1 VCC_PUISSANCE1 = 7460408: Bush with threaded hole M5; Manufacturer: WURTHZ; Max Current: 160A; Validated: False; Reference: 7460408; Material: CuZn39Pb3; Footprint description: Pressfit Bush with threaded hole M5; Pin Count: 1; helpURL: http://katalog.we-online.de/em/datasheet/7460408.pdf; Supplier 1: Farnell; Supplier Part Number 1: 1821279; Supplier 2: Mouser; Supplier Part Number 2: 710-7460408
P2 = 42820-3213: 3 pin power connector; Manufacturer: Molex; Max Voltage: 600V; Max Current: 50A; Validated: False; Reference: 42820-3213; Footprint description: Thu hole 10mm pitch; Pin Count: 3; Rev: D; helpURL: http://docs-europe.electrocomponents.com/webdocs/0d6c/0900766b80d6c7f6.pdf; Supplier 1: Newark; Supplier Part Number 1: 57K1485; Supplier 2: Mouser; Supplier Part Number 2: 538-42820-3213
Q1-Q6 = IPB017N06N3: 60V/180A N channel MOSFET in DPAK package; Manufacturer: INFINEON; Max Voltage: 60V; Max Current: 180A; Rated Power: 250W; Reference: IPB017N06N3; component type: NMOS; Footprint description: DPAK 8 pin; Pin Count: 8; Rev: 2.2; helpURL: https://www.infineon.com/dgdl/IPB017N06N3_Rev2.2.pdf?folderId=db3a30431441fb5d01148ca9f1be0e77&fileId=db3a30431ddc9372011e264a7ab746ea; Supplier 1: Farnell; Supplier Part Number 1: 1775519; Supplier 2: Mouser; Supplier Part Number 2: 726-IPB017N06N3G
R20 R21 R35 R39 = ERA3ARB102x: 1k 0.1%  0603 SMD resistor; Manufacturer: Panasonic; Value: 1 000; Rated Power: 0.1W; Validated: No; Reference: ERA3ARB102x; Tolerance: 0.1%; Footprint description: standard 0603 SMD; Pin Count: 2; helpURL: http://industrial.panasonic.com/www-data/pdf/AOA0000/AOA0000CE26.pdf; Supplier 1: Mouser; Supplier Part Number 1: 667-ERA-3ARB102V; Supplier 2: Farnell; Supplier Part Number 2: 1717570RL
R25 = CRCW0805118KFKxx: 118k Ohm 0805 SMD resistor; Manufacturer: Vishay; Value: 118 000; Tolerance: 1%; Rated Power: 0.125W; Validated: No; Reference: CRCW0805118KFKxx; Footprint description: standard 0805 SMD; Pin Count: 2; helpURL: http://www.vishay.com/docs/20035/dcrcwe3.pdf; Supplier 1: Mouser; Supplier Part Number 1: 71-CRCW0805-118K-E3; Supplier 2: Farnell; Supplier Part Number 2: 2316485
R26 = CRCW080513K3FKxx: 13k3 Ohm 0805 SMD resistor; Manufacturer: Vishay; Value: 13 300; Tolerance: 1%; Rated Power: 0.125W; Validated: No; Reference: CRCW080513K3FKxx; Footprint description: standard 0805 SMD; Pin Count: 2; helpURL: http://www.vishay.com/docs/20035/dcrcwe3.pdf; Supplier 1: Mouser; Supplier Part Number 1: 71-CRCW0805-13.3K-E3; Supplier 2: Farnell; Supplier Part Number 2: 1260840
R27 = CRCW080516K2FKxx: as R18 on sheet OZ440-SE100-CAR002-SCH01_logique - Copie; Reference: CRCW080516K2FKxx; Footprint description: standard 0805 SMD; Pin Count: 2; helpURL: http://www.vishay.com/docs/20035/dcrcwe3.pdf; Supplier 1: Mouser; Supplier Part Number 1: 71-CRCW0805-16.2K-E3; Supplier 2: Farnell; Supplier Part Number 2: 1469878
R28 = CRCW080553K6FKxx: 53k6 Ohm 0805 SMD resistor; Manufacturer: Vishay; Value: 53600; Tolerance: 1%; Rated Power: 0.125W; Validated: No; Reference: CRCW080553K6FKxx; Footprint description: standard 0805 SMD; Pin Count: 2; helpURL: http://www.vishay.com/docs/20035/dcrcwe3.pdf; Supplier 1: Mouser; Supplier Part Number 1: 71-CRCW080553K6FKEA; Supplier 2: Farnell; Supplier Part Number 2: 1185098
R29 = CRCW080510K0FKxx: as R4 on sheet OZ440-SE100-CAR002-SCH01_logique - Copie; Reference: CRCW080510K0FKxx; Footprint description: standard 0805 SMD; Pin Count: 2; helpURL: http://www.vishay.com/docs/20035/dcrcwe3.pdf; Supplier 1: Farnell; Supplier Part Number 1: 1469856; Supplier 2: Mouser; Supplier Part Number 2: 71-CRCW0805-10K-E3
R30 = CRCW0805220KFKxx: 220k Ohm 0805 SMD resistor; Manufacturer: Vishay; Value: 220 000; Tolerance: 1 %; Rated Power: 0,125 W; Validated: No; Reference: CRCW0805220KFKxx; Footprint description: standard 0805 SMD; Pin Count: 2; helpURL: http://www.vishay.com/docs/20035/dcrcwe3.pdf; Supplier 1: Farnell; Supplier Part Number 1: 1469653; Supplier 2: Mouser; Supplier Part Number 2: 71-CRCW0805220KFKEA
R31 = CRCW08053K00FKxx: 3k Ohm 0805 SMD resistor; Manufacturer: Vishay; Value: 3 000; Tolerance: 1 %; Rated Power: 0,125 W; Validated: No; Reference: CRCW08053K00FKxx; Footprint description: standard 0805 SMD; Pin Count: 2; helpURL: http://www.vishay.com/docs/20035/dcrcwe3.pdf; Supplier 1: Farnell; Supplier Part Number 1: 1469908; Supplier 2: Mouser; Supplier Part Number 2: 71-CRCW0805-3K-E3
R32-R34 R38 = CRCW08056K80FKxx: 6,8k Ohm 0805 SMD resistor; Manufacturer: Vishay; Value: 6 800; Tolerance: 1 %; Rated Power: 0,125 W; Validated: No; Reference: CRCW08056K80FKxx; Footprint description: standard 0805 SMD; Pin Count: 2; helpURL: http://www.vishay.com/docs/20035/dcrcwe3.pdf; Supplier 1: Farnell; Supplier Part Number 1: 1469949; Supplier 2: Mouser; Supplier Part Number 2: 71-CRCW0805-6.8K-E3
R36 R37 = ERJM1WTJ1M0U: 0.001R 1% 2512 SMD resistor; Manufacturer: PANASONIC; Value: 0.001; Rated Power: 2W; Validated: False; Reference: ERJM1WTJ1M0U; Tolerance: 1%; Footprint description: Standard 2512 SMD; Pin Count: 2; Rev: 02/2006; helpURL: http://www.panasonic.com/industrial/components/pdf/AOA0000CE7.pdf; Supplier 1: Farnell; Supplier Part Number 1: 2356459; Supplier 2: Mouser; Supplier Part Number 2: 667-ERJ-M1WTJ1M0U
U4 = DRV8301DCA: 3 phase MOSFET driver; Manufacturer: TI; Max Voltage: 60V; Max Current: 1.7A; Validated: False; Reference: DRV8301DCA; Footprint description: TSSOP56 with thermal pad; Pin Count: 56; Rev: 08/2011; helpURL: http://www.ti.com/lit/ds/symlink/drv8301.pdf; Supplier 1: Mouser; Supplier Part Number 1: 595-DRV8301DCAR; Supplier 2: Farnell; Supplier Part Number 2: 2057084
U5 = LM4040D41IDBZx: 4.096 shunt voltage reference; Manufacturer: TI; Max Current: 15mA; Validated: False; Reference: LM4040D41IDBZx; Footprint description: SOT23 SMD package; Pin Count: 3; Rev: 03/2008; helpURL: http://www.ti.com/lit/ds/symlink/lm4040d41.pdf; Supplier 1: Mouser; Supplier Part Number 1: 595-LM4040D41IDBZR; Supplier 2: Farnell; Supplier Part Number 2: 1575269
U6 = LM27313XMF: Boost converter 20V/ 800mA; Manufacturer: TI; Max Voltage: 12; Validated: False; Reference: LM27313XMF; Max Current: 800mA; Footprint description: SOT23-5; Pin Count: 5; Rev: 12/06; helpURL: http://www.ti.com/lit/ds/symlink/lm27313.pdf; Supplier 1: Mouser; Supplier Part Number 1: 926-LM27313XMFX/NOPB; Supplier 2: Farnell; Supplier Part Number 2: 1564771

## Nets that join several sheets
5V: OZ440-SE100-CAR002-SCH01_logique - Copie (13 pins), OZ440-SE100-CAR002-SCH02_puissance (9 pins)
12V: OZ440-SE100-CAR002-SCH01_logique - Copie (R15.2), OZ440-SE100-CAR002-SCH02_puissance (5 pins)
GND: OZ440-SE100-CAR002-SCH01_logique - Copie (31 pins), OZ440-SE100-CAR002-SCH02_puissance (45 pins)
~{FAULT}: OZ440-SE100-CAR002-SCH01_logique - Copie (U1.40), OZ440-SE100-CAR002-SCH02_puissance (U4.6)
~{OCTW}: OZ440-SE100-CAR002-SCH01_logique - Copie (U1.39), OZ440-SE100-CAR002-SCH02_puissance (U4.5)
ADC_REF: OZ440-SE100-CAR002-SCH01_logique - Copie (U1.22), OZ440-SE100-CAR002-SCH02_puissance (C12.2 R31.2 U4.24 U5.K)
BEMF_1: OZ440-SE100-CAR002-SCH01_logique - Copie (U1.24), OZ440-SE100-CAR002-SCH02_puissance (C38.2 R20.2 R32.1)
BEMF_2: OZ440-SE100-CAR002-SCH01_logique - Copie (U1.8), OZ440-SE100-CAR002-SCH02_puissance (C36.2 R21.2 R33.1)
BEMF_3: OZ440-SE100-CAR002-SCH01_logique - Copie (U1.9), OZ440-SE100-CAR002-SCH02_puissance (C37.2 R34.1 R35.2)
CURRENT_SENSE1: OZ440-SE100-CAR002-SCH01_logique - Copie (U1.21), OZ440-SE100-CAR002-SCH02_puissance (U4.25)
CURRENT_SENSE2: OZ440-SE100-CAR002-SCH01_logique - Copie (U1.20), OZ440-SE100-CAR002-SCH02_puissance (U4.26)
DC_CAL: OZ440-SE100-CAR002-SCH01_logique - Copie (U1.4), OZ440-SE100-CAR002-SCH02_puissance (U4.12)
EN_GATE: OZ440-SE100-CAR002-SCH01_logique - Copie (U1.25), OZ440-SE100-CAR002-SCH02_puissance (U4.16)
PH1_H_CMD: OZ440-SE100-CAR002-SCH01_logique - Copie (U1.41), OZ440-SE100-CAR002-SCH02_puissance (U4.17)
PH1_L_CMD: OZ440-SE100-CAR002-SCH01_logique - Copie (U1.36), OZ440-SE100-CAR002-SCH02_puissance (U4.18)
PH2_H_CMD: OZ440-SE100-CAR002-SCH01_logique - Copie (U1.2), OZ440-SE100-CAR002-SCH02_puissance (U4.19)
PH2_L_CMD: OZ440-SE100-CAR002-SCH01_logique - Copie (U1.44), OZ440-SE100-CAR002-SCH02_puissance (U4.20)
PH3_H_CMD: OZ440-SE100-CAR002-SCH01_logique - Copie (U1.3), OZ440-SE100-CAR002-SCH02_puissance (U4.21)
PH3_L_CMD: OZ440-SE100-CAR002-SCH01_logique - Copie (U1.1), OZ440-SE100-CAR002-SCH02_puissance (U4.22)
POWER_RAIL_MEAS: OZ440-SE100-CAR002-SCH01_logique - Copie (U1.26), OZ440-SE100-CAR002-SCH02_puissance (C40.2 R38.1 R39.2)
PWRGD: OZ440-SE100-CAR002-SCH01_logique - Copie (U1.38), OZ440-SE100-CAR002-SCH02_puissance (U4.4)
SPI_CLK: OZ440-SE100-CAR002-SCH01_logique - Copie (U1.37), OZ440-SE100-CAR002-SCH02_puissance (U4.11)
SPI_CS: OZ440-SE100-CAR002-SCH01_logique - Copie (U1.35), OZ440-SE100-CAR002-SCH02_puissance (U4.8)
SPI_MISO: OZ440-SE100-CAR002-SCH01_logique - Copie (U1.42), OZ440-SE100-CAR002-SCH02_puissance (U4.10)
SPI_MOSI: OZ440-SE100-CAR002-SCH01_logique - Copie (U1.43), OZ440-SE100-CAR002-SCH02_puissance (U4.9)

## Assembly variants
V1.0 - brushed motor -: not fitted C37 Q3 Q6 R34 R35
V5.0 - BLDC motor -: all parts fitted
Bineuse: not fitted C2 C8 C9 C11 C17 C28 C30 C31 C32 C33 C37 C41 D4 D6 D7 J1 L2 Q3 Q3 Q6 Q6 R1 R2 R3 R5 R7 R9 R10 R11 R12 R14 R16 R18 R19 R20 R21 R23 R24 R25 R26 R32 R33 R34 R34 R35 R35 R38 R39 SW1 U2 U3 U6